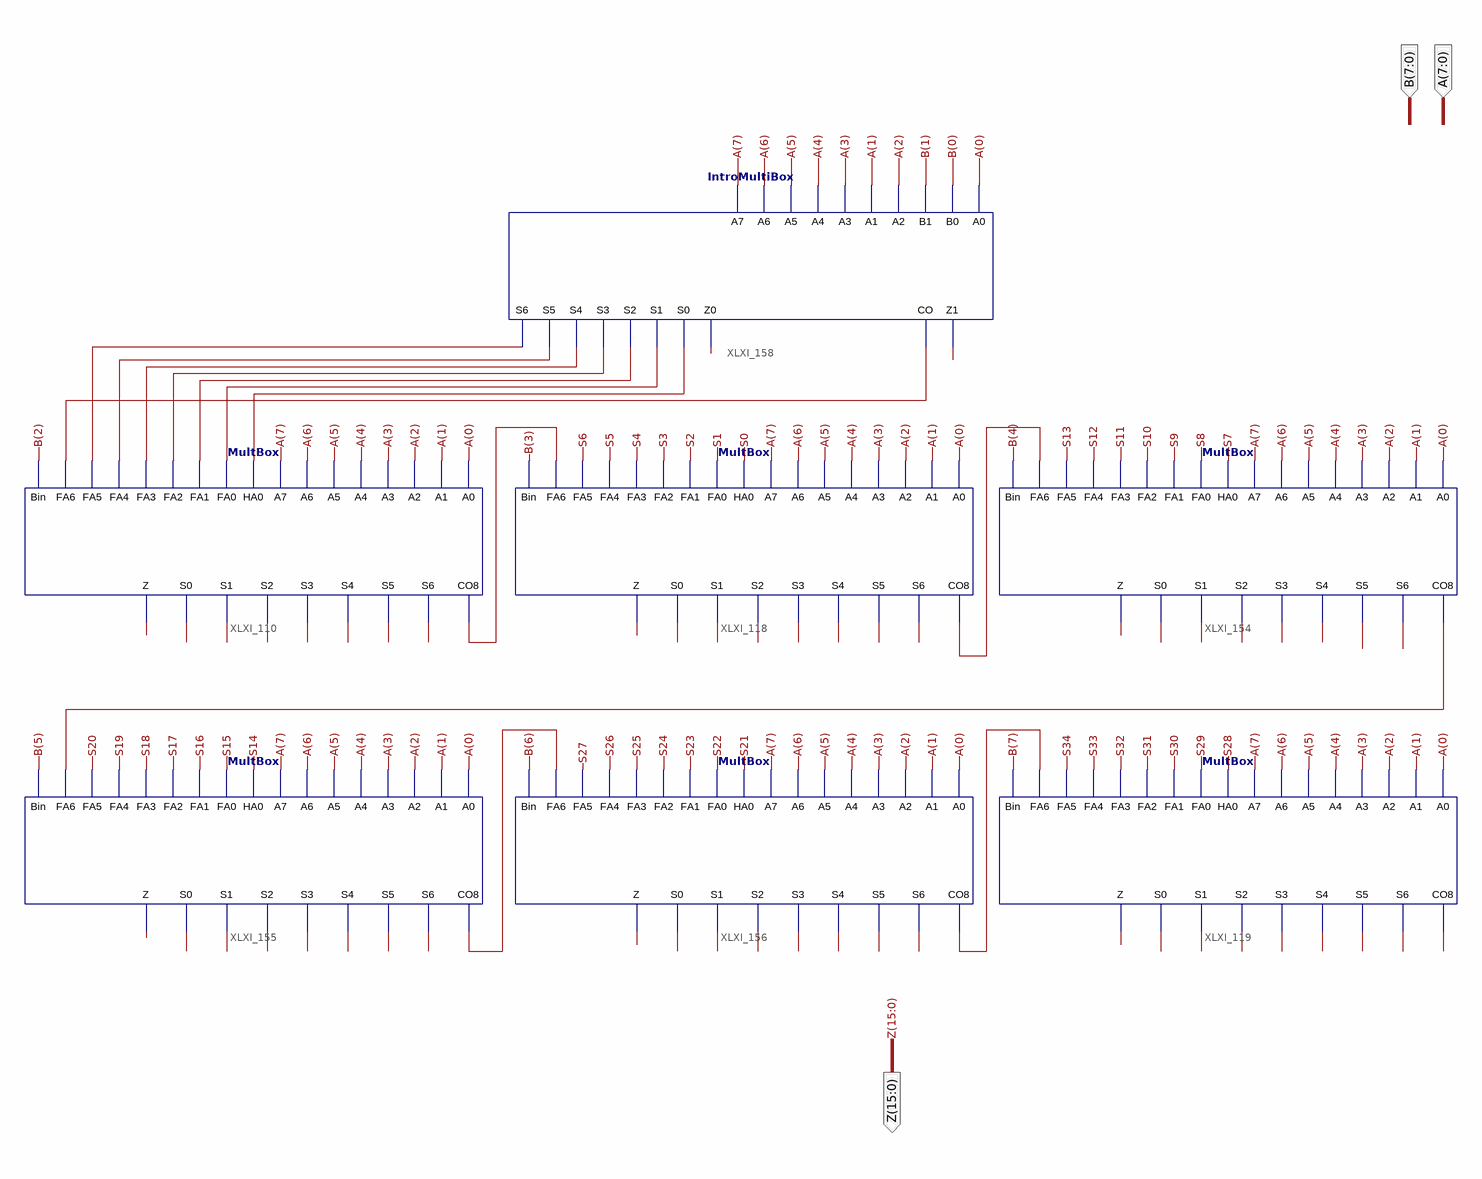
[diagram p0: schematic sheet 1]
// Xilinx ISE schematic EightBitMult.sch (spartan6) as structural Verilog: 7 symbols, 3 ports
module EightBitMult (
  input  [7:0] A,
  input  [7:0] B,
  output [15:0] Z
);

  wire CO0, CO2, CO3, CO4, S0, S1, S2, S3, S4, S5, S6, S7, S8, S9, S10, S11, S12, S13, S14, S15, S16, S17,
       S18, S19, S20, S21, S22, S23, S24, S25, S26, S27, S28, S29, S30, S31, S32, S33, S34, XLXN_13, XLXN_14,
       XLXN_15, XLXN_16, XLXN_17, XLXN_18, XLXN_19, XLXN_20, XLXN_27;

  MultBox XLXI_110 (
    .A0(A[0]), .A1(A[1]), .A2(A[2]), .A3(A[3]), .A4(A[4]), .A5(A[5]), .A6(A[6]), .A7(A[7]), .HA0(XLXN_14),
    .FA0(XLXN_15), .FA1(XLXN_16), .FA2(XLXN_17), .FA3(XLXN_18), .FA4(XLXN_19), .FA5(XLXN_20), .FA6(XLXN_13),
    .Bin(B[2]), .CO8(CO0), .S6(S6), .S5(S5), .S4(S4), .S3(S3), .S2(S2), .S1(S1), .S0(S0), .Z(Z[2]));
  MultBox XLXI_118 (
    .A0(A[0]), .A1(A[1]), .A2(A[2]), .A3(A[3]), .A4(A[4]), .A5(A[5]), .A6(A[6]), .A7(A[7]), .HA0(S0),
    .FA0(S1), .FA1(S2), .FA2(S3), .FA3(S4), .FA4(S5), .FA5(S6), .FA6(CO0), .Bin(B[3]), .CO8(XLXN_27),
    .S6(S13), .S5(S12), .S4(S11), .S3(S10), .S2(S9), .S1(S8), .S0(S7), .Z(Z[3]));
  MultBox XLXI_154 (
    .A0(A[0]), .A1(A[1]), .A2(A[2]), .A3(A[3]), .A4(A[4]), .A5(A[5]), .A6(A[6]), .A7(A[7]), .HA0(S7),
    .FA0(S8), .FA1(S9), .FA2(S10), .FA3(S11), .FA4(S12), .FA5(S13), .FA6(XLXN_27), .Bin(B[4]), .CO8(CO2),
    .S6(S20), .S5(S19), .S4(S18), .S3(S17), .S2(S16), .S1(S15), .S0(S14), .Z(Z[4]));
  MultBox XLXI_155 (
    .A0(A[0]), .A1(A[1]), .A2(A[2]), .A3(A[3]), .A4(A[4]), .A5(A[5]), .A6(A[6]), .A7(A[7]), .HA0(S14),
    .FA0(S15), .FA1(S16), .FA2(S17), .FA3(S18), .FA4(S19), .FA5(S20), .FA6(CO2), .Bin(B[5]), .CO8(CO3),
    .S6(S27), .S5(S26), .S4(S25), .S3(S24), .S2(S23), .S1(S22), .S0(S21), .Z(Z[5]));
  MultBox XLXI_156 (
    .A0(A[0]), .A1(A[1]), .A2(A[2]), .A3(A[3]), .A4(A[4]), .A5(A[5]), .A6(A[6]), .A7(A[7]), .HA0(S21),
    .FA0(S22), .FA1(S23), .FA2(S24), .FA3(S25), .FA4(S26), .FA5(S27), .FA6(CO3), .Bin(B[6]), .CO8(CO4),
    .S6(S34), .S5(S33), .S4(S32), .S3(S31), .S2(S30), .S1(S29), .S0(S28), .Z(Z[6]));
  MultBox XLXI_119 (
    .A0(A[0]), .A1(A[1]), .A2(A[2]), .A3(A[3]), .A4(A[4]), .A5(A[5]), .A6(A[6]), .A7(A[7]), .HA0(S28),
    .FA0(S29), .FA1(S30), .FA2(S31), .FA3(S32), .FA4(S33), .FA5(S34), .FA6(CO4), .Bin(B[7]), .CO8(Z[15]),
    .S6(Z[14]), .S5(Z[13]), .S4(Z[12]), .S3(Z[11]), .S2(Z[10]), .S1(Z[9]), .S0(Z[8]), .Z(Z[7]));
  IntroMultiBox XLXI_158 (
    .A0(A[0]), .B0(B[0]), .B1(B[1]), .A2(A[2]), .A1(A[1]), .A3(A[3]), .A4(A[4]), .A5(A[5]), .A6(A[6]),
    .A7(A[7]), .Z0(Z[0]), .Z1(Z[1]), .CO(XLXN_13), .S0(XLXN_14), .S1(XLXN_15), .S2(XLXN_16), .S3(XLXN_17),
    .S4(XLXN_18), .S5(XLXN_19), .S6(XLXN_20));
endmodule
